# EasyEDA schematic SCH_LFOx3_2024-04-05.json
TITLE: Katoomba LFOx3; REV: 1.0; Date: 2023-08-01; Sheet: 1/1; Drawn By: cashimor; Company: Mosha
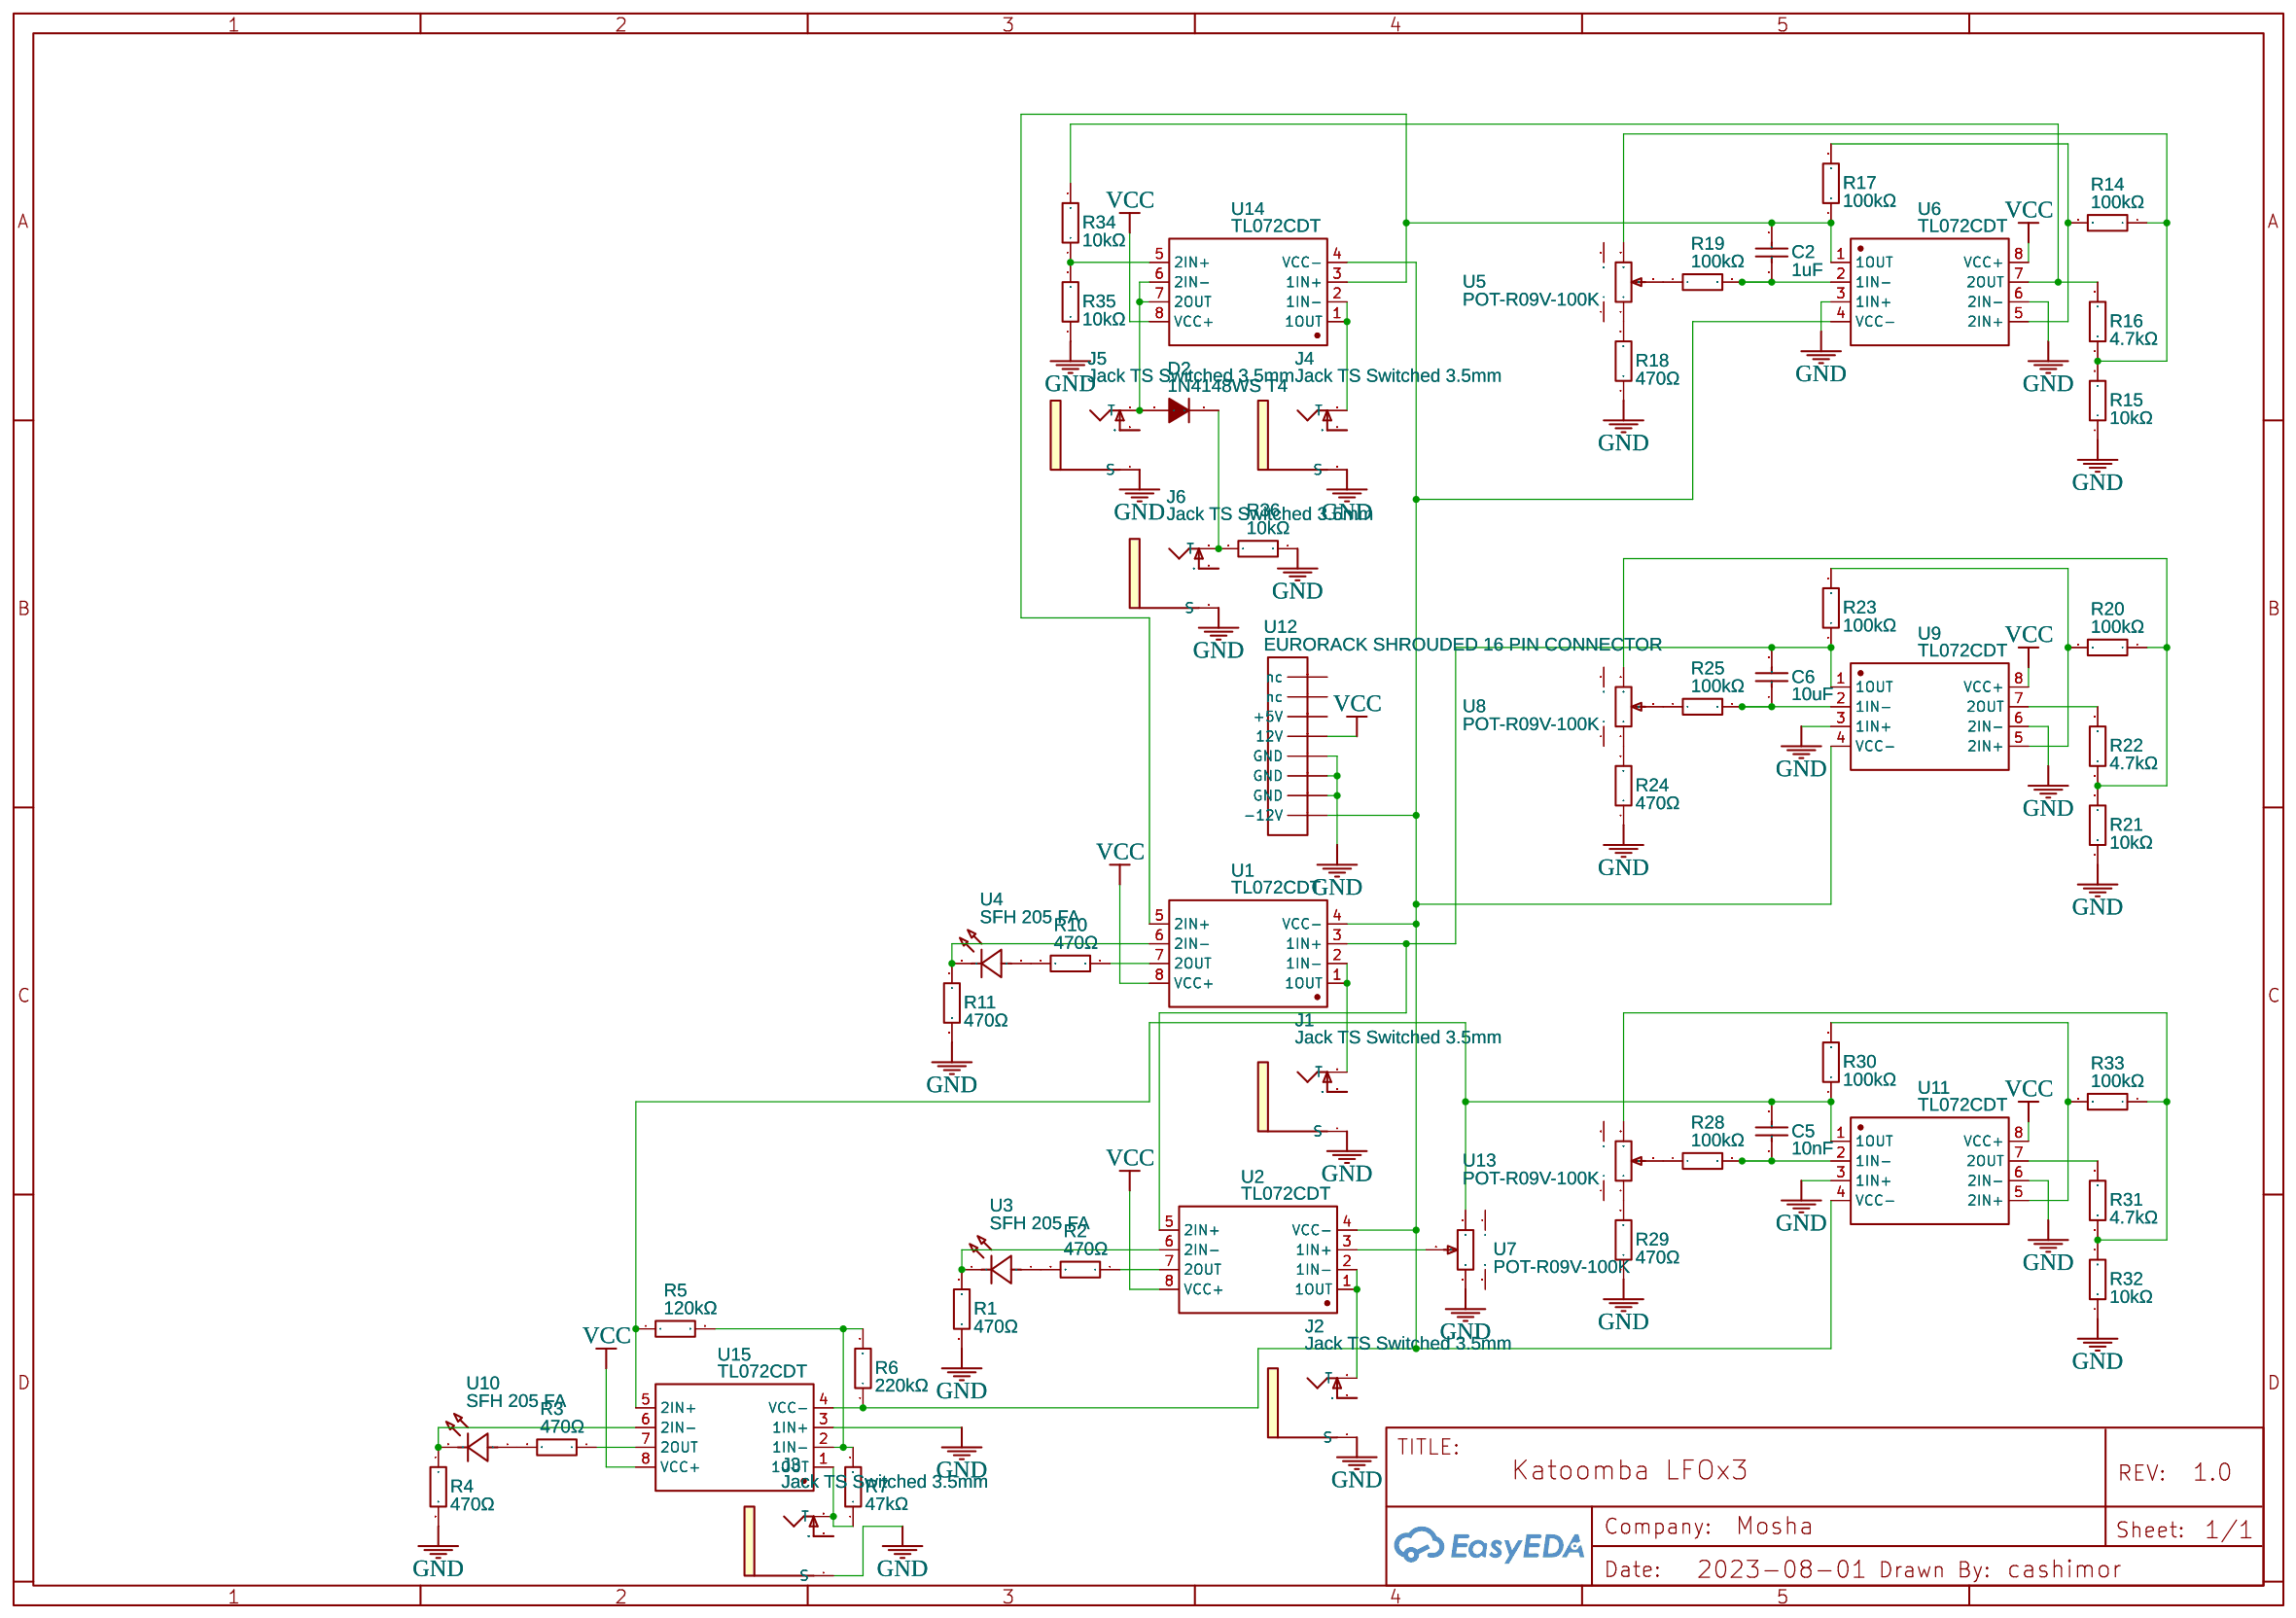
[diagram p0: schematic sheet]

## Parts
C2  1uF  [C0805]
C5  10nF  [C0603]
C6  10uF  [C0805]
D2  1N4148WS T4  [SOD-323_L1.8-W1.3-LS2.5-RD]
J1  Jack TS Switched 3.5mm  [QINGPU 3.5MM JACK EURORACK]
J2  Jack TS Switched 3.5mm  [QINGPU 3.5MM JACK EURORACK]
J3  Jack TS Switched 3.5mm  [QINGPU 3.5MM JACK EURORACK]
J4  Jack TS Switched 3.5mm  [QINGPU 3.5MM JACK EURORACK]
J5  Jack TS Switched 3.5mm  [QINGPU 3.5MM JACK EURORACK]
J6  Jack TS Switched 3.5mm  [QINGPU 3.5MM JACK EURORACK]
R1  470Ω  [R0805]
R2  470Ω  [R0805]
R3  470Ω  [R0805]
R4  470Ω  [R0805]
R5  120kΩ  [R0805]
R6  220kΩ  [R0603]
R7  47kΩ  [R0805]
R10  470Ω  [R0805]
R11  470Ω  [R0805]
R14  100kΩ  [R0402]
R15  10kΩ  [R0603]
R16  4.7kΩ  [R1206]
R17  100kΩ  [R0402]
R18  470Ω  [R0805]
R19  100kΩ  [R0402]
R20  100kΩ  [R0402]
R21  10kΩ  [R0603]
R22  4.7kΩ  [R1206]
R23  100kΩ  [R0402]
R24  470Ω  [R0805]
R25  100kΩ  [R0402]
R28  100kΩ  [R0402]
R29  470Ω  [R0805]
R30  100kΩ  [R0402]
R31  4.7kΩ  [R1206]
R32  10kΩ  [R0603]
R33  100kΩ  [R0402]
R34  10kΩ  [R0603]
R35  10kΩ  [R0603]
R36  10kΩ  [R0603]
U1  TL072CDT  [SOIC-8_L5.0-W4.0-P1.27-LS6.0-BL]
U2  TL072CDT  [SOIC-8_L5.0-W4.0-P1.27-LS6.0-BL]
U3  SFH 205 FA  [LED-TH_BD4.8-P2.54-FD]
U4  SFH 205 FA  [LED-TH_BD4.8-P2.54-FD]
U5  POT-R09V-100K  [RES-ADJ-TH_POT-R09V-100K]
U6  TL072CDT  [SOIC-8_L5.0-W4.0-P1.27-LS6.0-BL]
U7  POT-R09V-100K  [RES-ADJ-TH_POT-R09V-100K]
U8  POT-R09V-100K  [RES-ADJ-TH_POT-R09V-100K]
U9  TL072CDT  [SOIC-8_L5.0-W4.0-P1.27-LS6.0-BL]
U10  SFH 205 FA  [LED-TH_BD4.8-P2.54-FD]
U11  TL072CDT  [SOIC-8_L5.0-W4.0-P1.27-LS6.0-BL]
U12  EURORACK SHROUDED 16 PIN CONNECTOR  [EURORACK SHROUDED POWER 16 PIN]
U13  POT-R09V-100K  [RES-ADJ-TH_POT-R09V-100K]
U14  TL072CDT  [SOIC-8_L5.0-W4.0-P1.27-LS6.0-BL]
U15  TL072CDT  [SOIC-8_L5.0-W4.0-P1.27-LS6.0-BL]

## Library data of the parts
C2 = CL21B105KBFNNNE: Supplier: LCSC; Manufacturer: SAMSUNG(三星); Supplier Part: C28323; JLCPCB Part Class: Basic Part; link: https://lcsc.com/eda_search?q=C28323&%26type=1&ref=editor
C5 = 0603B103K500NT: Supplier: LCSC; Manufacturer: FH(风华); Supplier Part: C57112; JLCPCB Part Class: Basic Part; link: https://lcsc.com/eda_search?q=C57112&%26type=1&ref=editor
C6 = CL21A106KAYNNNE: Supplier: LCSC; Manufacturer: SAMSUNG(三星); Supplier Part: C15850; JLCPCB Part Class: Basic Part; link: https://lcsc.com/eda_search?q=C15850&%26type=1&ref=editor
D2 = 1N4148WS T4: Supplier: LCSC; Manufacturer: CJ(江苏长电/长晶); Manufacturer Part: 1N4148WS; Supplier Part: C2128; JLCPCB Part Class: Basic Part; link: https://lcsc.com/eda_search?q=C2128&%26type=1&ref=editor
J1-J6 = Jack TS Switched 3.5mm: Contributor: Abe Friedman
R1-R4 R10 R11 R18 R24 R29 = 0805W8F4700T5E: Supplier: LCSC; Manufacturer: UNI-ROYAL(厚声); Supplier Part: C17710; JLCPCB Part Class: Basic Part; link: https://lcsc.com/eda_search?q=C17710&%26type=1&ref=editor
R5 = 0805W8F1203T5E: Supplier: LCSC; Manufacturer: UNI-ROYAL(厚声); Supplier Part: C17436; JLCPCB Part Class: Basic Part; link: https://lcsc.com/eda_search?q=C17436&%26type=1&ref=editor
R6 = 0603WAF2203T5E: Supplier: LCSC; Manufacturer: UNI-ROYAL(厚声); Supplier Part: C22961; JLCPCB Part Class: Basic Part; link: https://lcsc.com/eda_search?q=C22961&%26type=1&ref=editor
R7 = 0805W8F4702T5E: Supplier: LCSC; Manufacturer: UNI-ROYAL(厚声); Supplier Part: C17713; JLCPCB Part Class: Basic Part; link: https://lcsc.com/eda_search?q=C17713&%26type=1&ref=editor
R14 R17 R19 R20 R23 R25 R28 R30 R33 = 0402WGF1003TCE: Supplier: LCSC; Manufacturer: UNI-ROYAL(厚声); Supplier Part: C25741; JLCPCB Part Class: Basic Part; link: https://lcsc.com/eda_search?q=C25741&%26type=1&ref=editor
R15 R21 R32 R34-R36 = 0603WAF1002T5E: Supplier: LCSC; Manufacturer: UNI-ROYAL(厚声); Supplier Part: C25804; JLCPCB Part Class: Basic Part; link: https://lcsc.com/eda_search?q=C25804&%26type=1&ref=editor
R16 R22 R31 = 1206W4F4701T5E: Supplier: LCSC; Manufacturer: UNI-ROYAL(厚声); Supplier Part: C17936; JLCPCB Part Class: Basic Part; link: https://lcsc.com/eda_search?q=C17936&%26type=1&ref=editor
U1 U2 U6 U9 U11 U14 U15 = TL072CDT: Supplier: LCSC; Manufacturer: ST(意法半导体); Supplier Part: C6961; JLCPCB Part Class: Basic Part; link: https://lcsc.com/eda_search?q=C6961&%26type=1&ref=editor
U3 U4 U10 = SFH 205 FA: Contributor: LCSC; Supplier: LCSC; Supplier Part: C2900208; Manufacturer: OSRAM(欧司朗); link: https://lcsc.com/eda_search?q=C2900208&%26type=1&ref=editor
U5 U7 U8 U13 = POT-R09V-100K: Contributor: lcsc; Supplier: LCSC; Supplier Part: C9900018037; Manufacturer: null; JLCPCB Part Class: Extended Part; link: https://lcsc.com/eda_search?q=C9900018037&%26type=1&ref=editor
U12 = EURORACK SHROUDED 16 PIN CONNECTOR: Manufacturer Part: New SchematicLib; Contributor: eduard.frentescu

## Nets
GND: J1.1(S) J2.1(S) J3.1(S) J4.1(S) J5.1(S) J6.1(S) R1.2 R4.2 R11.2 R15.1 R18.1 R21.1 R24.1 R29.1 R32.1 R35.1 R36.1 U6.3(1IN+) U6.6(2IN-) U7.3 U9.3(1IN+) U9.6(2IN-) U11.3(1IN+) U11.6(2IN-) U12.2(GND) U12.3(GND) U12.4(GND) U15.3(1IN+)
VCC: U1.8(VCC+) U2.8(VCC+) U6.8(VCC+) U9.8(VCC+) U11.8(VCC+) U12.5(12V) U14.8(VCC+) U15.8(VCC+)
Net-(C2-1): C2.1 R19.2 U6.2(1IN-)
Net-(C2-2): C2.2 R17.1 U1.5(2IN+) U6.1(1OUT) U14.3(1IN+)
Net-(C5-1): C5.1 R28.2 U11.2(1IN-)
Net-(C5-2): C5.2 R5.1 R30.1 U7.1 U11.1(1OUT) U15.5(2IN+)
Net-(C6-1): C6.1 R25.2 U9.2(1IN-)
Net-(C6-2): C6.2 R23.1 U1.3(1IN+) U2.5(2IN+) U9.1(1OUT)
Net-(D2-1): D2.1(K) J6.3(T) R36.2
Net-(D2-2): D2.2(A) J5.3(T) U14.6(2IN-) U14.7(2OUT)
Net-(J1-3): J1.3(T) U1.1(1OUT) U1.2(1IN-)
Net-(J2-3): J2.3(T) U2.1(1OUT) U2.2(1IN-)
Net-(J3-3): J3.3(T) R7.1 U15.1(1OUT)
Net-(J4-3): J4.3(T) U14.1(1OUT) U14.2(1IN-)
Net-(R1-1): R1.1 U2.6(2IN-) U3.2(K)
Net-(R2-1): R2.1 U2.7(2OUT)
Net-(R2-2): R2.2 U3.1(A)
Net-(R3-1): R3.1 U15.7(2OUT)
Net-(R3-2): R3.2 U10.1(A)
Net-(R4-1): R4.1 U10.2(K) U15.6(2IN-)
Net-(R5-2): R5.2 R6.2 R7.2 U15.2(1IN-)
Net-(R6-1): R6.1 U1.4(VCC-) U2.4(VCC-) U6.4(VCC-) U9.4(VCC-) U11.4(VCC-) U12.1(-12V) U14.4(VCC-) U15.4(VCC-)
Net-(R10-1): R10.1 U1.7(2OUT)
Net-(R10-2): R10.2 U4.1(A)
Net-(R11-1): R11.1 U1.6(2IN-) U4.2(K)
Net-(R14-1): R14.1 R15.2 R16.1 U5.3
Net-(R14-2): R14.2 R17.2 U6.5(2IN+)
Net-(R16-2): R16.2 R34.2 U6.7(2OUT)
Net-(R18-2): R18.2 U5.1
Net-(R19-1): R19.1 U5.2
Net-(R20-1): R20.1 R21.2 R22.1 U8.3
Net-(R20-2): R20.2 R23.2 U9.5(2IN+)
Net-(R22-2): R22.2 U9.7(2OUT)
Net-(R24-2): R24.2 U8.1
Net-(R25-1): R25.1 U8.2
Net-(R28-1): R28.1 U13.2
Net-(R29-2): R29.2 U13.1
Net-(R30-2): R30.2 R33.2 U11.5(2IN+)
Net-(R31-1): R31.1 R32.2 R33.1 U13.3
Net-(R31-2): R31.2 U11.7(2OUT)
Net-(R34-1): R34.1 R35.2 U14.5(2IN+)
Net-(U2-3): U2.3(1IN+) U7.2

Not connected (* = marked no-connect by the designer): J1 2(Tsw); J2 2(Tsw); J3 2(Tsw); J4 2(Tsw); J5 2(Tsw); J6 2(Tsw); U5 4 5; U7 4 5; U8 4 5; U12 6(+5V) 7(nc) 8(nc); U13 4 5
